# EAGLE design As Shipped (EAGLE 6.4)
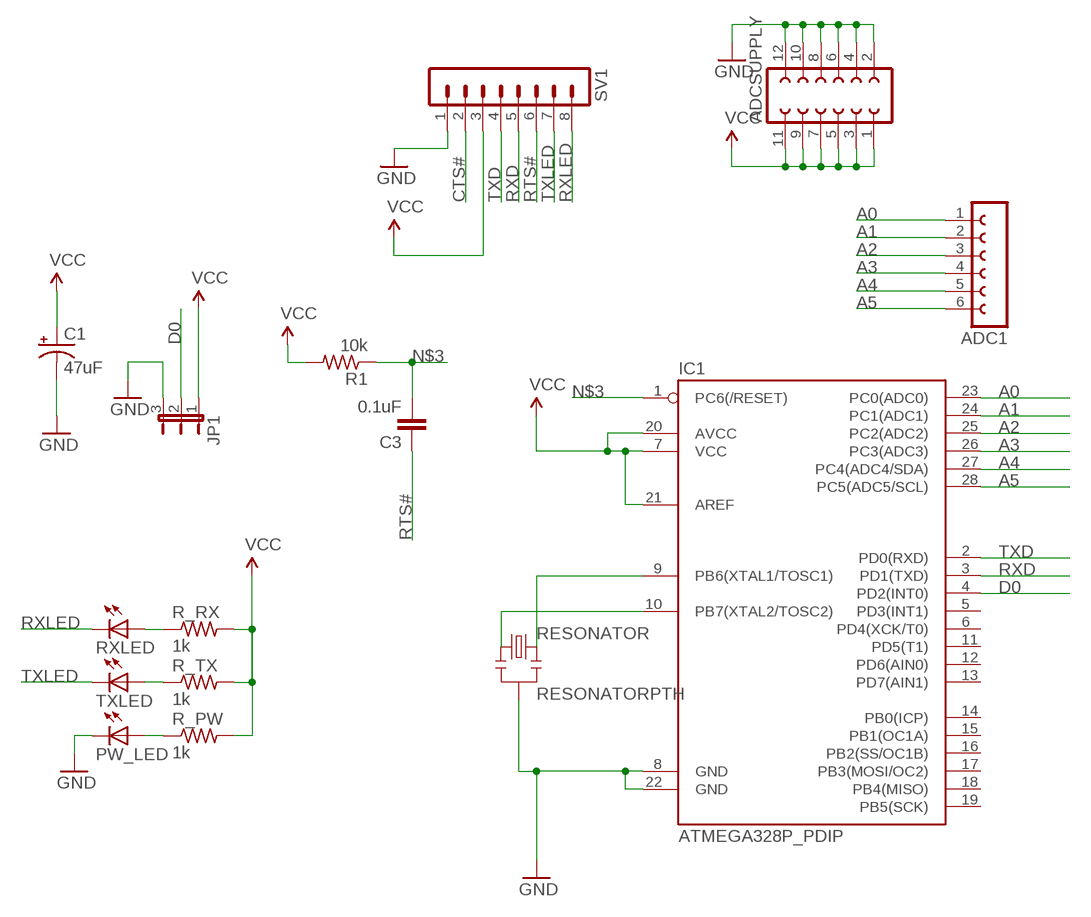
[diagram p0: schematic, sheet 1]

## Parts
ADC1  FE06-1  [FE06]
ADCSUPPLY  FE06-2  [FE06-2]
C1  47uF  CPOL-USE2,5-6E  [E2,5-6E]
C3  0.1uF  CAP0402-CAP  [0402-CAP]
IC1  ATMEGA328P_PDIP  [DIL28-3]
JP1  JP2E  [JP2]
PW_LED  LED5MM  [LED5MM]
R1  10k  R-US_R0805  [R0805]
R_PW  1k  R-US_R0805  [R0805]
R_RX  1k  R-US_R0805  [R0805]
R_TX  1k  R-US_R0805  [R0805]
RESONATOR  RESONATORPTH  [RESONATOR-PTH]
RXLED  LED5MM  [LED5MM]
SV1  MA08-1W  [MA08-1W]
TXLED  LED5MM  [LED5MM]

## Nets
A0: ADC1.1 IC1.23(PC0(ADC0))
A1: ADC1.2 IC1.24(PC1(ADC1))
A2: ADC1.3 IC1.25(PC2(ADC2))
A3: ADC1.4 IC1.26(PC3(ADC3))
A4: ADC1.5 IC1.27(PC4(ADC4/SDA))
A5: ADC1.6 IC1.28(PC5(ADC5/SCL))
CTS#: SV1.2
D0: IC1.4(PD2(INT0)) JP1.2
GND: ADCSUPPLY.2 ADCSUPPLY.4 ADCSUPPLY.6 ADCSUPPLY.8 ADCSUPPLY.10 ADCSUPPLY.12 C1.- IC1.8(GND) IC1.22(GND) JP1.3 PW_LED.K(C) RESONATOR.2 SV1.1
N$1: IC1.9(PB6(XTAL1/TOSC1)) RESONATOR.3
N$2: IC1.10(PB7(XTAL2/TOSC2)) RESONATOR.1
N$3: C3.2 IC1.1(PC6(/RESET)) R1.1
N$4: R_TX.1 TXLED.A
N$5: R_RX.1 RXLED.A
N$6: PW_LED.A R_PW.1
POWER: ADCSUPPLY.1 ADCSUPPLY.3 ADCSUPPLY.5 ADCSUPPLY.7 ADCSUPPLY.9 ADCSUPPLY.11 C1.+ IC1.7(VCC) IC1.20(AVCC) IC1.21(AREF) JP1.1 R1.2 R_PW.2 R_RX.2 R_TX.2 SV1.3 ; supply symbol labelled VCC
RTS#: C3.1 SV1.6
RXD: IC1.3(PD1(TXD)) SV1.5
RXLED: RXLED.K(C) SV1.8
TXD: IC1.2(PD0(RXD)) SV1.4
TXLED: SV1.7 TXLED.K(C)
Unconnected: IC1.5(PD3(INT1)) IC1.6(PD4(XCK/T0)) IC1.11(PD5(T1)) IC1.12(PD6(AIN0)) IC1.13(PD7(AIN1)) IC1.14(PB0(ICP)) IC1.15(PB1(OC1A)) IC1.16(PB2(SS/OC1B)) IC1.17(PB3(MOSI/OC2)) IC1.18(PB4(MISO)) IC1.19(PB5(SCK))

## Library data of the parts
ADC1 = con-lsta:FE06-1: FEMALE HEADER; OC_FARNELL: unknown; OC_NEWARK: unknown
ADCSUPPLY = con-lsta:FE06-2: FEMALE HEADER; OC_FARNELL: unknown; OC_NEWARK: unknown
C1 = rcl:CPOL-US: POLARIZED CAPACITOR, American symbol
C3 = SparkFun-Capacitors:CAP: Capacitor Standard 0603 ceramic capacitor, and 0.1" leaded capacitor.
IC1 = SparkFun-DigitalIC:ATMEGA328P_PDIP: uC used in the Arduino 32kb flash, 1k EEPROM, 2k SRAM This is the through-hole version of this chip.
JP1 = jumper:JP2E: JUMPER
PW_LED RXLED TXLED = SparkFun-LED:LED: LEDs Standard schematic elements and footprints for 5mm, 3mm, 1206, and 0603 sized LEDs. 5mm - Spark Fun Electronics SKU : COM-00529 (and others)
R1 R_PW R_RX R_TX = rcl:R-US_: RESISTOR, American symbol
RESONATOR = SparkFun-FreqCtrl:RESONATOR: Resonator Small SMD resonator. Used, eg, on the Arduino Pro/ Pro Mini boards. 8MHz- XTAL-08895 16MHz- XTAL-08900
SV1 = con-lstb:MA08-1W: PIN HEADER; OC_FARNELL: unknown; OC_NEWARK: unknown

## Board
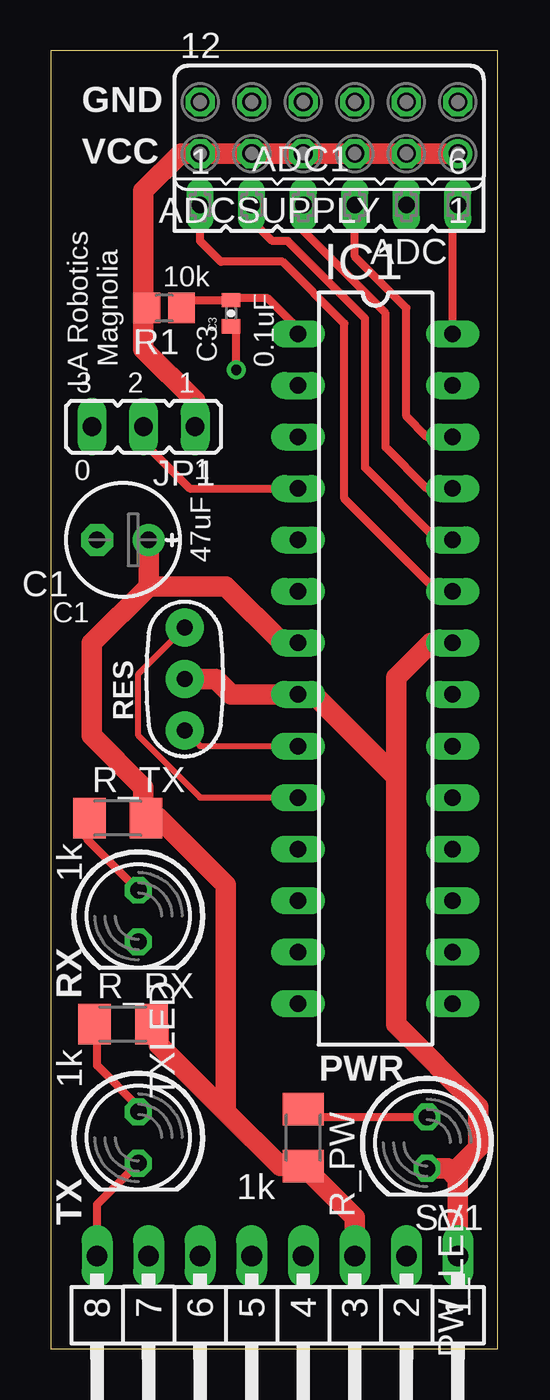
[diagram p1: board, top side]
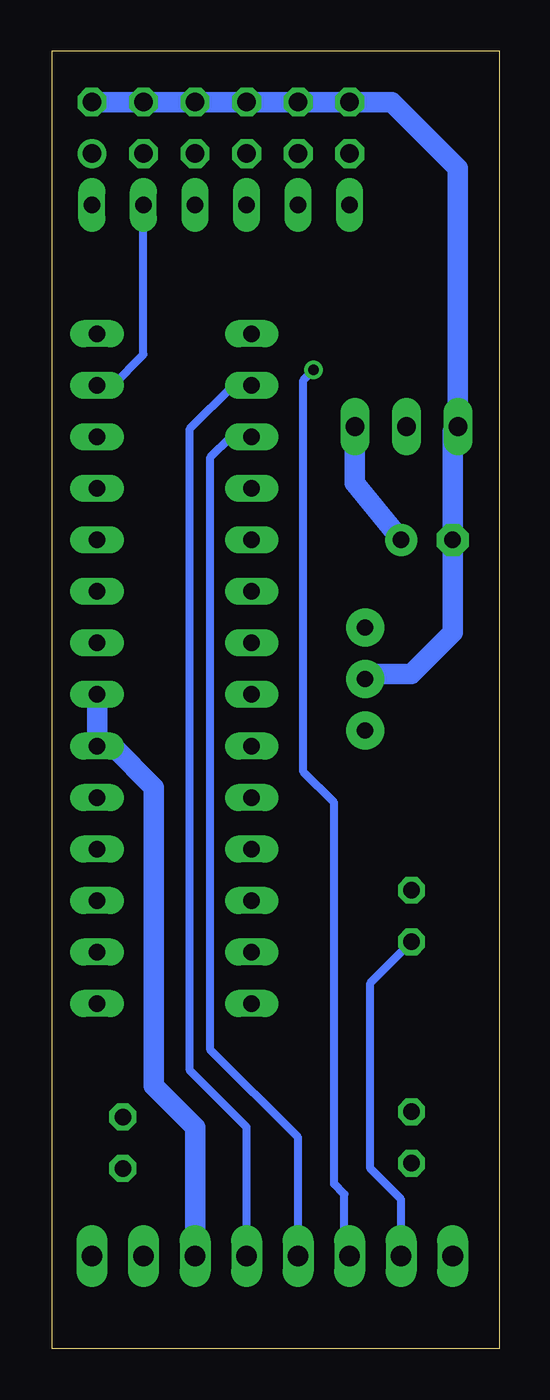
[diagram p2: board, bottom side, seen from below]

Size 22.02 x 64 mm. Coordinates in mm from the lower left corner, seen from the top.
Outline: 0,0 22.02,0 22.02,64 0,64 0,0
Copper layers (1*16): Top 0.035mm / dielectric 1.5mm / Bottom 0.035mm
Design rules "default": minimum track width 10mil, minimum drill 24mil, track to track 8mil, track to pad 8mil, pad to pad 8mil, via to via 8mil, smd to smd 8mil, copper to edge 40mil, drill to drill 8mil, minimum pad ring 10mil, minimum via ring 8mil, stop-mask expansion 4mil, vias tented up to drill 0mil, thermal gap 10mil

### Footprints (pad centres in the part's own frame; a part is rotated, then mirrored left to right if it is on the bottom)
FE06 = drill 0.813 long: 1 -6.35,0; 2 -3.81,0; 3 -1.27,0; 4 1.27,0; 5 3.81,0; 6 6.35,0
FE06-2 = drill 0.914: 1 -6.35,1.27 | drill 0.914 octagon: 2 -6.35,-1.27; 3 -3.81,1.27; 4 -3.81,-1.27; 5 -1.27,1.27; 6 -1.27,-1.27; 7 1.27,1.27; 8 1.27,-1.27; 9 3.81,1.27; 10 3.81,-1.27; 11 6.35,1.27; 12 6.35,-1.27
E2,5-6E = drill 0.813 pad 1.575: + -1.27,0 | drill 0.813 pad 1.575 octagon: - 1.27,0
0402-CAP = smd 0.7 x 0.9: 1 -0.65,0; 2 0.65,0
DIL28-3 = drill 0.813 long: 1 -16.51,-3.81; 2 -13.97,-3.81; 3 -11.43,-3.81; 4 -8.89,-3.81; 5 -6.35,-3.81; 6 -3.81,-3.81; 7 -1.27,-3.81; 8 1.27,-3.81; 9 3.81,-3.81; 10 6.35,-3.81; 11 8.89,-3.81; 12 11.43,-3.81; 13 13.97,-3.81; 14 16.51,-3.81; 15 16.51,3.81; 16 13.97,3.81; 17 11.43,3.81; 18 8.89,3.81; 19 6.35,3.81; 20 3.81,3.81; 21 1.27,3.81; 22 -1.27,3.81; 23 -3.81,3.81; 24 -6.35,3.81; 25 -8.89,3.81; 26 -11.43,3.81; 27 -13.97,3.81; 28 -16.51,3.81
JP2 = drill 0.914 long: 1 -2.54,0; 2 0,0; 3 2.54,0
LED5MM = drill 0.813 octagon: A -1.27,0; K 1.27,0
R0805 = smd 1.3 x 1.5: 1 -0.85,0; 2 0.85,0
M3216 = smd 1.6 x 2: 1 -1.4,0; 2 1.4,0
RESONATOR-PTH = drill 0.8 pad 1.88: 1 -2.54,0; 2 0,0; 3 2.54,0
MA08-1W = drill 1.016 long: 1 -8.89,0; 2 -6.35,0; 3 -3.81,0; 4 -1.27,0; 5 1.27,0; 6 3.81,0; 7 6.35,0; 8 8.89,0

### Placement (x,y rotation side)
ADC1  13.72,56.39 0 top
ADCSUPPLY  13.72,60.2 180 top
C1  3.56,39.88 180 top
C3  8.89,51.05 90 top
IC1  16,33.53 270 top
JP1  4.57,45.47 180 top
PW_LED  18.54,10.16 270 top
R1  5.59,51.31 180 top
R_PW  1k  [M3216]  12.45,10.41 270 top
R_RX  1k  [M3216]  3.56,16 0 top
R_TX  1k  [M3216]  3.3,26.16 0 top
RESONATOR  6.6,33.02 270 top
RXLED  4.32,10.41 270 top
SV1  11.18,4.57 180 top
TXLED  4.32,21.34 270 top

### Tracks (layer width: path | path; a pad name or v marks a point on that pad's centre or on a via)
A0
  Top 0.406: IC1.23 19.05,37.34 14.48,41.91 14.48,50.55 11.43,53.59 8.38,53.59 7.37,54.61 ADC1.1
A1
  Top 0.406: IC1.24 19.05,39.88 15.49,43.43 15.49,50.8 11.68,54.61 10.92,54.61 9.91,55.63 ADC1.2
A2
  Top 0.406: IC1.25 18.54,42.42 16.51,44.45 16.51,51.05 12.45,55.12 ADC1.3
A3
  Top 0.406: IC1.26 18.54,44.96 17.53,45.97 17.53,51.31 14.99,53.85 ADC1.4
A4
  Bottom 0.406: IC1.27 19.05,47.5 17.53,49.02 ADC1.5
A5
  Top 0.406: IC1.28 19.81,56.13 ADC1.6
D0
  Top 0.406: JP1.2 4.57,44.7 6.86,42.42 IC1.4
GND
  Top 1.016: SV1.1 20.07,8.38 | 20.07,8.38 20.07,8.89 21.08,9.91 21.08,11.94 17.02,16 17.02,28.19 | 17.02,28.19 17.02,33.09 18.72,34.8 IC1.22 | 17.02,28.19 12.95,32.26 IC1.8 8.89,32.26 8.13,33.02 RESONATOR.2 | PW_LED.K 19.56,8.89 20.07,8.38
  Bottom 1.016: RESONATOR.2 6.35,33.27 4.32,33.27 2.29,35.31 C1.- 2.29,45.21 JP1.3 2.03,55.88 2.03,56.39 2.03,58.22 5.29,61.47 ADCSUPPLY.12 ADCSUPPLY.10 ADCSUPPLY.8 ADCSUPPLY.6 ADCSUPPLY.4 ADCSUPPLY.2
N$1
  Top 0.305: IC1.9 7.37,29.72 RESONATOR.3
N$2
  Top 0.305: IC1.10 7.37,27.18 4.32,30.23 4.32,33.27 RESONATOR.1
N$3
  Top 0.406: IC1.1 12.19,50.29 10.67,51.82 9,51.82 C3.2 6.83,51.7 R1.1
N$4
  Top 0.406: TXLED.A 1.78,25.15 1.78,26.04 R_TX.1
N$5
  Top 0.406: RXLED.A 4.32,11.94 2.29,13.97 2.29,15.88 R_RX.1
N$6
  Top 0.406: PW_LED.A 12.83,11.43 R_PW.1
POWER
  Top 1.016: SV1.3 14.99,6.47 R_PW.2 11.31,9.01 8.64,11.68 | 8.64,11.68 5.33,14.99 5.33,15.88 R_RX.2 | ADCSUPPLY.1 ADCSUPPLY.3 ADCSUPPLY.5 ADCSUPPLY.7 ADCSUPPLY.9 ADCSUPPLY.11 6.4,58.93 4.57,57.1 4.57,56.13 4.57,51.31 | 8.64,11.68 8.64,22.86 5.33,26.16 R_TX.2 4.57,26.29 4.57,27.69 2.03,30.23 2.03,34.8 4.83,37.59 | 4.83,37.59 C1.+ | IC1.7 11.43,34.8 8.64,37.59 4.83,37.59 | JP1.1 7.11,46.74 4.57,49.28 4.57,51.31 | 4.57,51.31 R1.2
  Bottom 1.016: SV1.3 14.99,10.92 17.02,12.95 17.02,27.69 19.05,29.72 IC1.20 IC1.21 | C1.+ 7.11,42.67 JP1.1
RTS#  (via drill 0.51)
  Top 0.406: v9.14,48.26 9.14,50.15 C3.1
  Bottom 0.406: SV1.6 7.62,4.57 7.62,7.62 8.13,8.13 8.13,26.92 9.65,28.45 9.65,47.75 v9.14,48.26
RXD
  Bottom 0.406: SV1.5 9.91,10.41 14.22,14.73 14.22,43.96 13.22,44.96 IC1.3
RXLED
  Top 0.406: SV1.8 2.29,7.11 RXLED.K
TXD
  Bottom 0.406: SV1.4 12.45,10.92 15.24,13.72 15.24,45.36 13.1,47.5 IC1.2
TXLED
  Bottom 0.406: SV1.7 4.83,7.37 6.35,8.89 6.35,18.03 TXLED.K

### Text on the board
_tsilk: GND | VCC | ADC | Magnolia | 10k | C3 | 0.1uF | LA Robotics | 0 | 1 | 47uF | C1 | RES | 1k | RX | 1k | PWR | 1k | TX | 8 | 7 | 6 | 5 | 4 | 3 | 2 | 1